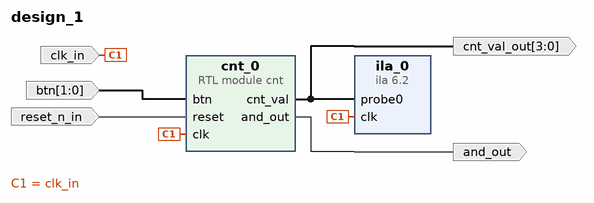
[diagram p0: block diagram of the top level]
# Vivado block design design_1, xc7z020clg484-1, Vivado 2018.3
create_bd_design design_1

create_bd_port -dir O -from 3 -to 0 cnt_val_out
create_bd_port -dir I -type clk clk_in
set_property -dict {CONFIG.FREQ_HZ 100000000} [get_bd_ports clk_in]
create_bd_port -dir O and_out
create_bd_port -dir I -from 1 -to 0 btn
create_bd_port -dir I -type rst reset_n_in

create_bd_cell -type module -reference cnt cnt_0
create_bd_cell -type ip -vlnv xilinx.com:ip:ila:6.2 ila_0
set_property -dict [list \
  CONFIG.C_ENABLE_ILA_AXI_MON false \
  CONFIG.C_MONITOR_TYPE Native \
  CONFIG.C_NUM_OF_PROBES 1 \
  CONFIG.C_PROBE0_WIDTH 4 \
] [get_bd_cells ila_0]

# ---- connections ----

connect_bd_net [get_bd_pins cnt_0/cnt_val] [get_bd_ports cnt_val_out] [get_bd_pins ila_0/probe0]
connect_bd_net [get_bd_ports clk_in] [get_bd_pins cnt_0/clk] [get_bd_pins ila_0/clk]
connect_bd_net [get_bd_pins cnt_0/and_out] [get_bd_ports and_out]
connect_bd_net [get_bd_ports btn] [get_bd_pins cnt_0/btn]
connect_bd_net [get_bd_ports reset_n_in] [get_bd_pins cnt_0/reset]

validate_bd_design
save_bd_design
